# EasyEDA Pro project 可调电源.eprj, schematic 功率板
Board Name: Board1; Create Date: 2025-12-10; Page Name: p1; Project Name: 可调电源; Schematic Name: 功率板; Update Date: 2026-01-13; Company: 嘉立创EDA; Page Size: A4; Version: V1.0
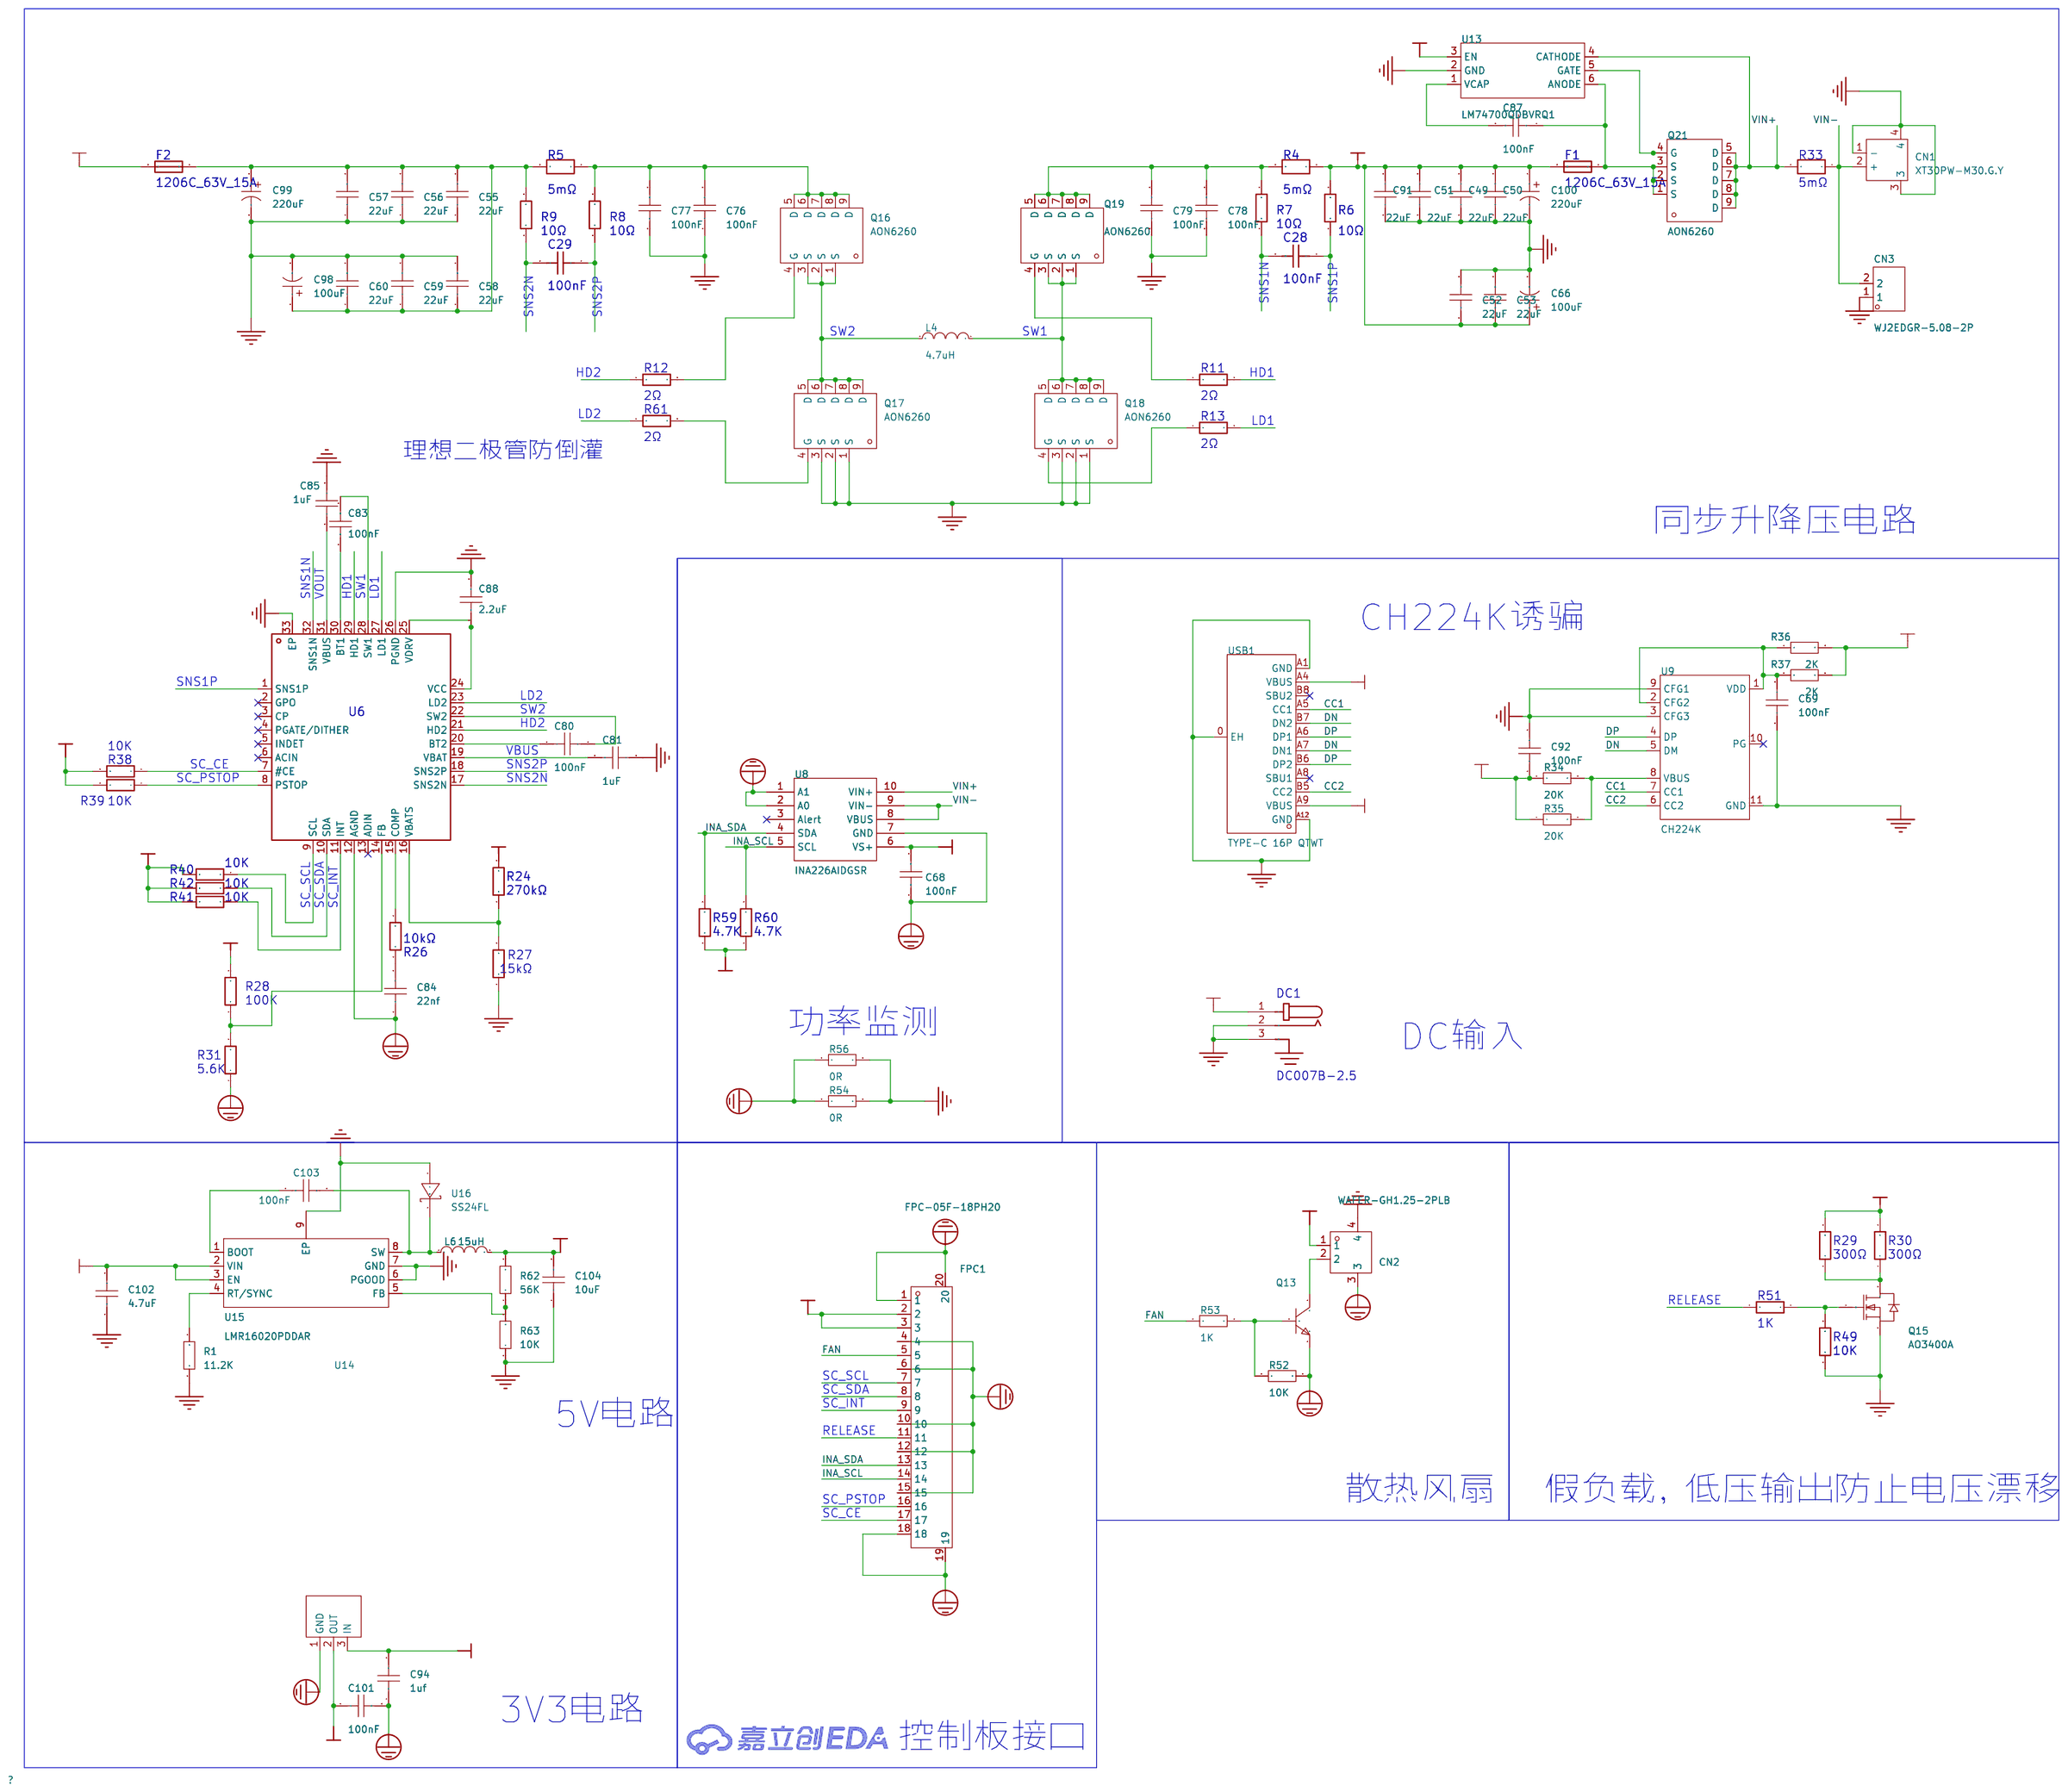
[diagram p0: schematic sheet]

## Parts
C28  100nF  [C0402]
C29  100nF  [C0402]
C49  22uF  [C1206]
C50  22uF  [C1206]
C51  22uF  [C1206]
C52  22uF  [C1206]
C53  22uF  [C1206]
C55  22uF  [C1206]
C56  22uF  [C1206]
C57  22uF  [C1206]
C58  22uF  [C1206]
C59  22uF  [C1206]
C60  22uF  [C1206]
C66  100uF  [CAP-SMD_BD8.0-L8.3-W8.3-LS9.0-FD]
C68  100nF  [C0603]
C69  100nF  [C0603]
C76  100nF  [C0603]
C77  100nF  [C0603]
C78  100nF  [C0603]
C79  100nF  [C0603]
C80  100nF  [C0402]
C81  1uF  [C0402]
C83  100nF  [C0402]
C84  22nf  [C0402]
C85  1uF  [C0402]
C87  100nF  [C0603]
C88  2.2uF  [C0402]
C91  22uF  [C1206]
C92  100nF  [C0603]
C94  1uf  [C0603]
C98  100uF  [CAP-SMD_BD8.0-L8.3-W8.3-LS9.0-FD]
C99  220uF  [CAP-SMD_BD10.0-L10.3-W10.3-FD-1]
C100  220uF  [CAP-SMD_BD10.0-L10.3-W10.3-FD-1]
C101  100nF  [C0603]
C102  4.7uF  [C0603]
C103  100nF  [C0603]
C104  10uF  [C0603]
CN1  XT30PW-M30.G.Y  [CONN-TH_XT30PW-M]
CN2  WAFER-GH1.25-2PLB  [CONN-TH_2P-P1.25_XUNPU_WAFER-GH1.25-2PLB]
CN3  WJ2EDGR-5.08-2P  [CONN-TH_WJ2EDGR-5.08-2P]
DC1  DC007B-2.5  [DC-IN-TH_HX-DC007B-2.5]
F1  1206C_63V_15A  [F1206]
F2  1206C_63V_15A  [F1206]
FPC1  FPC-05F-18PH20  [FPC-SMD_18P-P0.50_FPC-05F-18PH20]
L4  4.7uH  [IND-SMD_L13.45-W12.6]
L6  15uH  [IND-SMD_L4.0-W4.0]
Q13  -  [S8050_SOT-23]
Q15  AO3400A  [SOT-23-3_L2.9-W1.3-P1.90-LS2.4-BR]
Q16  AON6260  [PG-TDSON-8_L5.9-W5.2-P1.27-LS6.2-BL-EP]
Q17  AON6260  [PG-TDSON-8_L5.9-W5.2-P1.27-LS6.2-BL-EP]
Q18  AON6260  [PG-TDSON-8_L5.9-W5.2-P1.27-LS6.2-BL-EP]
Q19  AON6260  [PG-TDSON-8_L5.9-W5.2-P1.27-LS6.2-BL-EP]
Q21  AON6260  [PG-TDSON-8_L5.9-W5.2-P1.27-LS6.2-BL-EP]
R1  11.2K  [R0402]
R4  5mΩ  [R1206]
R5  5mΩ  [R1206]
R6  10Ω  [R0402]
R7  10Ω  [R0402]
R8  10Ω  [R0402]
R9  10Ω  [R0402]
R11  2Ω  [R0402]
R12  2Ω  [R0402]
R13  2Ω  [R0402]
R24  270kΩ  [R0402]
R26  10kΩ  [R0402]
R27  15kΩ  [R0402]
R28  100K  [R0402]
R29  300Ω  [R1206]
R30  300Ω  [R1206]
R31  5.6K  [R0402]
R33  5mΩ  [R1206]
R34  20K  [R0603]
R35  20K  [R0603]
R36  2K  [R0603]
R37  2K  [R0603]
R38  10K  [R0402]
R39  10K  [R0402]
R40  10K  [R0402]
R41  10K  [R0402]
R42  10K  [R0402]
R49  10K  [R0402]
R51  1K  [R0402]
R52  10K  [R0402]
R53  1K  [R0402]
R54  0R  [R0603]
R56  0R  [R0603]
R59  4.7K  [R0402]
R60  4.7K  [R0402]
R61  2Ω  [R0402]
R62  56K  [R0402]
R63  10K  [R0402]
U6  SC8815QDER  [QFN-32_L4.0-W4.0-P0.40-BL-EP2.7]
U8  INA226AIDGSR  [MSOP-10_L3.0-W3.0-P0.50-LS5.0-BL]
U9  CH224K  [ESSOP-10_L4.9-W3.9-P1.0-LS6.0-TL-EP]
U13  LM74700QDBVRQ1  [SOT-23-6_L2.9-W1.6-P0.95-LS2.8-BL]
U14  SCJA1117B-3.3-A  [SOT-89-3L_L4.5-W2.5-P1.50-LS4.1-BR]
U15  LMR16020PDDAR  [SOIC-8_L4.9-W3.9-P1.27-LS6.0-BL-EP]
U16  SS24FL  [SOD-123FL_L2.8-W1.8-LS3.6-RD]
USB1  TYPE-C 16P QTWT  [USB-TYPE-C-SMD_TYPE-C-16P-QTWT]

## Library data of the parts
C28 C29 = CL05B104KB54PNC: LCSC Part Name: 100nF ±10% 50V; Supplier Part: C307331; Manufacturer: SAMSUNG(三星); Supplier Footprint: 0402; JLCPCB Part Class: 基础库; Datasheet: https://atta.szlcsc.com/upload/public/pdf/source/20181009/C307331_222F7C870FD3EA5F46F538B483443886.pdf; Supplier: LCSC; Tolerance: ±10%; Voltage Rated: 50V; Temperature Coefficient: X7R
C49-C53 C55-C60 C91 = CAP_1206: Supplier Footprint: 1206
C66 C98 = SPT1JM470F09TRVZC: LCSC Part Name: 47uF ±20% 63V; Supplier Part: C48686160; Manufacturer: Yunxing(云星); Supplier Footprint: SMD,D8xL9mm; JLCPCB Part Class: 扩展库; Datasheet: https://item.szlcsc.com/datasheet/SPT1JM470F09TRVZC/50971402.html; Supplier: LCSC; Tolerance: ±20%; Voltage Rating: 63V; Pin Spacing: 3.5mm; Diameter: 8mm; Height - Seated (Max): 9mm; Lifetime: 2000hrs@105℃; Operating Temperature: -55℃~+105℃
C68 C69 C76-C79 C87 C92 C94 C101-C104 = CAP_0603: Supplier Footprint: 0603
C80 C81 C83-C85 C88 = CAP_0402: Supplier Footprint: 0402
C99 C100 = MA50V220M10x10: LCSC Part Name: 220uF ±20% 50V; Supplier Part: C46550473; Manufacturer: JIERR(捷而瑞); Supplier Footprint: SMD,D10xL10mm; JLCPCB Part Class: 扩展库; Datasheet: https://item.szlcsc.com/datasheet/MA50V220M10x10/48680167.html; Supplier: LCSC; Tolerance: ±20%; Voltage Rating: 50V; Ripple Current: 3.1A@100kHz; Equivalent Series Resistance(ESR): 30mΩ@100kHz; Type: 聚合物; Diameter: 10mm; Height - Seated (Max): 10mm; Lifetime: 2000hrs@105℃; Operating Temperature: -55℃~+105℃
CN1 = XT30PW-M30.G.Y: LCSC Part Name: AMASS(艾迈斯)航模插头 卧式弯脚 XT30PW-M公头; Supplier Part: C431092; Manufacturer: AMASS(艾迈斯); JLCPCB Part Class: 扩展库; Datasheet: https://item.szlcsc.com/datasheet/XT30PW-M30.G.Y/426930.html; Supplier: LCSC; Type: 航模插头; RatedVoltage: DC 500V; InterfaceType: 公头; RatedCurrent: 15A; RecommendedWireGauge: 16/18/20AWG; contact resistance: 1.2mΩ; specifications: 2pin
CN2 = WAFER-GH1.25-2PLB: LCSC Part Name: 1x2P 间距:1.25mm 立贴 系列:GH; Supplier Part: C3029368; Manufacturer: XUNPU(讯普); Supplier Footprint: SMD,P=1.25mm; JLCPCB Part Class: 扩展库; Datasheet: https://item.szlcsc.com/datasheet/WAFER-GH1.25-2PLB/3561380.html; Supplier: LCSC; Pins Structure: 1x2P; Pitch: 1.25mm; Mounting Type: 立贴; Reference Series: GH; Number of Pins: 2P; Number of Rows: 1; Number of PINs Per Row: 2; Current Rating: 1A; Contact Material: 黄铜; Contact Plating: 锡; Operating Temperature: -25℃~+85℃; Voltage Rating: 125V; Plastic Material: LCP; Supplementary Features: 辅助焊脚; Color: 米色; Z-Height of the Board: 4.2mm; X-Length of Bottom Edge on Board (Spacing Line): 5.75mm; Y-Width of Bottom Edge on Board: 4.95mm
CN3 = WJ2EDGR-5.08-2P: LCSC Part Name: 1x2P 5.08mm 排数:1 每排P数:2; Supplier Part: C8383; Manufacturer: KANGNEX(康奈克斯电气); Supplier Footprint: 弯插,P=5.08mm; JLCPCB Part Class: 扩展库; Datasheet: https://item.szlcsc.com/datasheet/WJ2EDGR-5.08-2P/8877.html; Supplier: LCSC; Connector Type: 板端/插座-开口; Number of Positions or Pins: 1x2P; Pitch: 5.08mm; Color: 绿色; Mounting Type: 弯针; Number of Pins: 2P; Number of Rows: 1; Number of PINs Per Row: 2; Operating Temperature: -40℃~+105℃
DC1 = DC007B-2.5: LCSC Part Name: DC电源插座 内径:2.5mm 外径:7.7mm; Supplier Part: C17701685; Manufacturer: SHOU HAN(首韩); Supplier Footprint: 插件; JLCPCB Part Class: 扩展库; Datasheet: https://atta.szlcsc.com/upload/public/pdf/source/20230912/B85EC3863CDA4EDD9FBFF38F4F2C356A.pdf; Supplier: LCSC; Connector Type: DC电源插座; Mounting Type: 弯插; Inside Contact Diameter: 2.5mm; Outside Contact Diameter: 7.7mm; Current Rating: 5A; Voltage Rating (Max): 20V; Operating Temperature: -25℃~+70℃
F1 F2 = BSMD1206C-2150T: LCSC Part Name: 1206 15A 32V 一次性 慢速熔断; Supplier Part: C41367234; Manufacturer: BHFUSE(佰宏); Supplier Footprint: 1206; JLCPCB Part Class: 扩展库; Datasheet: https://item.szlcsc.com/datasheet/BSMD1206C-2150T/43118987.html; Supplier: LCSC; Type: 贴片式保险丝; Current Rating: 15A; Voltage Rating (DC): 32V; Operating Temperature: -55℃~+150℃; Melting I2t: 18.2; Interrupt Rating: 150A
FPC1 = FPC-05F-18PH20: LCSC Part Name: 翻盖式 卧贴 P数:18P 间距:0.5mm; Supplier Part: C2856802; Manufacturer: XUNPU(讯普); Supplier Footprint: SMD,P=0.5mm,卧贴; JLCPCB Part Class: 扩展库; Datasheet: https://item.szlcsc.com/datasheet/FPC-05F-18PH20/3056900.html; Supplier: LCSC; Locking Feature: 翻盖式; Contact Type: 卧贴; Number of Contacts: 18P; Pitch: 0.5mm; Mounting Type: 下接; FFC, FCB Thickness: 0.3mm; Height Above Board: 2mm; Contact Material: 磷青铜; Contact Plating: 锡; Operating Temperature: -25℃~+85℃; Rated Voltage (Max): 50V; Current Rating (Max): 500mA
L4 = FXL1360-4R7-M: LCSC Part Name: 4.7uH ±20% 24A; Supplier Part: C526021; Manufacturer: cjiang(长江微电); Supplier Footprint: SMD,13.5x12.6mm; JLCPCB Part Class: 扩展库; Datasheet: https://item.szlcsc.com/datasheet/FXL1360-4R7-M/544126.html; Supplier: LCSC; Tolerance: ±20%; Current Rating: 20A; Current - Saturation(Isat): 24A; DC Resistance(DCR): 9mΩ; Type: 一体成型电感
L6 = FHD4020S-150MT: LCSC Part Name: 15uH ±20% 2.8A; Supplier Part: C602033; Manufacturer: cjiang(长江微电); Supplier Footprint: SMD,4x4mm; JLCPCB Part Class: 扩展库; Datasheet: https://atta.szlcsc.com/upload/public/pdf/source/20200609/C601990_BCEA243EC4DA0A9A288AA78A6DFB48A5.pdf; Supplier: LCSC; Tolerance: ±20%; Current Rating: 1.2A; Current - Saturation(Isat): 2.8A; DC Resistance(DCR): 305mΩ; Type: 绕线电感
Q13 = S8050_SOT_NPN: Supplier Footprint: SOT-23
Q15 = AO3400A_C20917: LCSC Part Name: 1个N沟道 耐压:30V 电流:5.7A; Supplier Part: C20917; Manufacturer: AOS; Supplier Footprint: SOT-23-3L; JLCPCB Part Class: 基础库; Datasheet: https://item.szlcsc.com/datasheet/AO3400A/21629.html; Supplier: LCSC; Drain to Source Voltage: 30V; RDS(on): 48mΩ@2.5V; Gate Threshold Voltage (Vgs(th)): 1.45V@250uA; Gate Charge(Qg): 7nC@10V; Input Capacitance(Ciss): 630pF@15V; Operating Temperature: -55℃~+150℃@(Tj); Type: N沟道
Q16-Q19 Q21 = AON6260: LCSC Part Name: 1个N沟道 耐压:60V 电流:41A 电流:85A; Supplier Part: C3288308; Manufacturer: AOS; Supplier Footprint: DFN-8(5x6); JLCPCB Part Class: 扩展库; Supplier: LCSC; Type: 1个N沟道; Drain Source Voltage (Vdss): 60V; Continuous Drain Current (Id): 85A；41A; Power Dissipation (Pd): 7.3W；104W; Drain Source On Resistance (RDS(on)@Vgs,Id): 2.4mΩ@20A,10V; Gate Threshold Voltage (Vgs(th)@Id): 2.5V@250uA; Total Gate Charge (Qg@Vgs): 115nC@10V; Input Capacitance (Ciss@Vds): 5.578nF@30V; Operating Temperature: -55℃~+150℃@(Tj)
R1 R52 R53 R62 R63 = Res_0402: Supplier Footprint: 0402
R4 R5 R33 = RLP25FEGMR010: LCSC Part Name: 10mΩ ±1% 3W; Supplier Part: C393072; Manufacturer: 大毅科技; Supplier Footprint: 2512; JLCPCB Part Class: Extended Part; Datasheet: https://atta.szlcsc.com/upload/public/pdf/source/20190801/C393072_75E0D801B8B57DDBFF67497AD9E82245.pdf; Supplier: LCSC; Type: 采样电阻; Tolerance: ±1%; Power(Watts): 3W; Temperature Coefficient: ±50ppm/℃; Mounting Sytle: 贴片
R6-R9 R11-R13 R61 = 0402WGF100JTCE: LCSC Part Name: 10Ω ±1% 62.5mW; Supplier Part: C25077; Manufacturer: UNI-ROYAL(厚声); Supplier Footprint: 0402; JLCPCB Part Class: 基础库; Datasheet: https://atta.szlcsc.com/upload/public/pdf/source/20200306/C422600_1E6D84923E4A46A82E41ADD87F860B5C.pdf; Supplier: LCSC; Type: 厚膜电阻; Tolerance: ±1%; Power(Watts): 62.5mW; Temperature Coefficient: ±200ppm/℃; Overload Voltage (Max): 50V; Operating Temperature Range: -55℃~+155℃
R24 = 0402WGF3302TCE: LCSC Part Name: 33kΩ ±1% 62.5mW; Supplier Part: C25779; Manufacturer: UNI-ROYAL(厚声); Supplier Footprint: 0402; JLCPCB Part Class: Basic Part; Datasheet: https://atta.szlcsc.com/upload/public/pdf/source/20200306/C422600_1E6D84923E4A46A82E41ADD87F860B5C.pdf; Supplier: LCSC; Type: 厚膜电阻; Tolerance: ±1%; Power(Watts): 62.5mW; Temperature Coefficient: ±100ppm/℃; Overload Voltage (Max): 50V; Operating Temperature Range: -55℃~+155℃
R26 = 0402WGF1002TCE: LCSC Part Name: 10kΩ ±1% 62.5mW; Supplier Part: C25744; Manufacturer: UNI-ROYAL(厚声); Supplier Footprint: 0402; JLCPCB Part Class: Basic Part; Datasheet: https://atta.szlcsc.com/upload/public/pdf/source/20200306/C422600_1E6D84923E4A46A82E41ADD87F860B5C.pdf; Supplier: LCSC; Type: 厚膜电阻; Tolerance: ±1%; Power(Watts): 62.5mW; Temperature Coefficient: ±100ppm/℃; Overload Voltage (Max): 50V; Operating Temperature Range: -55℃~+155℃; Check: true
R27 = 0402WGF1003TCE: LCSC Part Name: 100kΩ ±1% 62.5mW; Supplier Part: C25741; Manufacturer: UNI-ROYAL(厚声); Supplier Footprint: 0402; JLCPCB Part Class: Basic Part; Datasheet: https://atta.szlcsc.com/upload/public/pdf/source/20200306/C422600_1E6D84923E4A46A82E41ADD87F860B5C.pdf; Supplier: LCSC; Type: 厚膜电阻; Tolerance: ±1%; Power(Watts): 62.5mW; Temperature Coefficient: ±100ppm/℃; Overload Voltage (Max): 50V; Operating Temperature Range: -55℃~+155℃; Check: true
R28 R31 R38-R42 = RT0402BRD076K8L: LCSC Part Name: 6.8kΩ ±0.1% 62.5mW; Supplier Part: C281779; Manufacturer: YAGEO(国巨); Supplier Footprint: 0402; JLCPCB Part Class: 扩展库; Datasheet: https://atta.szlcsc.com/upload/public/pdf/source/20180906/C281779_D5427F576E6A8D3F24941A4EF74441F3.pdf; Supplier: LCSC; Type: 薄膜电阻; Tolerance: ±0.1%; Power(Watts): 62.5mW; Temperature Coefficient: ±25ppm/℃; Overload Voltage (Max): 50V; Operating Temperature Range: -55℃~+155℃
R29 R30 = 1206W4F100JT5E: LCSC Part Name: 10Ω ±1% 250mW 厚膜电阻; Supplier Part: C17903; Manufacturer: UNI-ROYAL(厚声); Supplier Footprint: 1206; JLCPCB Part Class: 基础库; Datasheet: https://atta.szlcsc.com/upload/public/pdf/source/20200306/C422600_1E6D84923E4A46A82E41ADD87F860B5C.pdf; Supplier: LCSC; Type: 厚膜电阻; Tolerance: ±1%; Power(Watts): 250mW; Overload Voltage (Max): 200V; Temperature Coefficient: ±400ppm/℃; Operating Temperature Range: -55℃~+155℃
R34-R37 R54 R56 = Res_0603: Supplier Footprint: 0603
R49 R51 R59 R60 = 0402WGF5101TCE: LCSC Part Name: 5.1KΩ(5101) ±1% 编带; Supplier Part: C25905; Manufacturer: UNI-ROYAL(厚声); Supplier Footprint: 0402; JLCPCB Part Class: Basic Part; Datasheet: https://atta.szlcsc.com/upload/public/pdf/source/20170920/C25905_1505895107382980911.pdf; Supplier: LCSC
U6 = SC8815QDER: link: https://item.szlcsc.com/213663.html; 3DModel: QFN-32_L4.0-W4.0-H0.8-P0.40; Supplier: LCSC; Supplier Part: C429908; Manufacturer: SOUTHCHIP(南芯); JLCPCB Part Class: 扩展库
U8 = INA226AIDGSR: Supplier Part: C49851; Manufacturer: TI(德州仪器); Supplier Footprint: MSOP-10; JLCPCB Part Class: 扩展库; Datasheet: https://item.szlcsc.com/datasheet/INA226AIDGSR/50860.html; Supplier: LCSC; Vcm - Common Mode Voltage: 300mV~40V; Ib - Input Bias Current: 10nA; Vos - Input Offset Voltage: 2.5uV; Operating Temperature: -40℃~+125℃; Differential Voltage: -40V~+40V; Single Supply: 2.7V~5.5V; Quiescent Current: 330uA; Input Offset Voltage Drift(Vos TC): 0.1uV/℃; Common Mode Rejection Ratio (CMRR): 140dB
U9 = CH224K: LCSC Part Name: USBPD等多快充协议受电芯片CH224; Supplier Part: C970725; Manufacturer: WCH(南京沁恒); Supplier Footprint: ESSOP-10-150mil-1mm; JLCPCB Part Class: 扩展库; Datasheet: https://item.szlcsc.com/datasheet/CH224K/1060460.html; Supplier: LCSC
U13 = LM74700QDBVRQ1_C2941042: LCSC Part Name: 低IQ电池反向保护理想二极管控制器; Supplier Part: C2941042; Manufacturer: TI(德州仪器); Supplier Footprint: SOT-23-6; JLCPCB Part Class: 扩展库; Datasheet: https://www.ti.com/cn/lit/gpn/lm74700-q1; Supplier: LCSC
U14 = SCJA1117B-3.3-A: LCSC Part Name: 低压差线性稳压器; Supplier Part: C2829327; Manufacturer: CJ(江苏长电/长晶); Supplier Footprint: SOT-89-3L; JLCPCB Part Class: 扩展库; Datasheet: https://item.szlcsc.com/datasheet/SCJA1117B-3.3-A/2979408.html; Supplier: LCSC; Output Type: 固定; Voltage - Supply: 15V; Output Voltage: 3.3V; Output Current: 1A; Power Supply Rejection Ratio (PSRR): 60dB@(1kHz); Voltage Dropout: 1.3V@(1A); standby current: 5mA; Features: 过热保护；过流保护; Operating Temperature: -20℃~+125℃@(Tj); Output Configuration: 正极; Number of Outputs: 1
U15 = LMR16020PDDAR: LCSC Part Name: 60V、2A降压转换器; Supplier Part: C190006; Manufacturer: TI(德州仪器); Supplier Footprint: SOIC-8-EP; JLCPCB Part Class: 扩展库; Datasheet: https://www.ti.com/cn/lit/gpn/lmr16020; Supplier: LCSC; Function: 降压型; Output Type: 可调; Voltage - Supply: 4.3V~60V; Output Voltage: 800mV~50V; Output Current: 2A; Frequency - Switching: 2.5MHz; Operating Temperature: -40℃~+125℃@(TJ); Synchronous Rectifier: 否; Number of Outputs: 1; Topology: 降压式; Switch tube (built-in/external): 内置
U16 = SS24FL_C894433: LCSC Part Name: 电压:40V 电流:2A; Supplier Part: C894433; Manufacturer: onsemi(安森美); Supplier Footprint: SOD-123F; JLCPCB Part Class: 扩展库; Datasheet: https://item.szlcsc.com/datasheet/SS24FL/959862.html; Supplier: LCSC; Voltage - Forward(Vf@If): 550mV@2A; Voltage - DC Reverse(Vr): 40V; Current - Rectified: 2A; Reverse Leakage Current (Ir): 100uA@40V; Operating Junction Temperature Range: -55℃~+125℃; Non-Repetitive Peak Forward Surge Current: 50A
USB1 = TYPE-C 16P QTWT: LCSC Part Name: Type-C 母 卧贴; Supplier Part: C5187472; Manufacturer: SHOU HAN(首韩); Supplier Footprint: SMD; JLCPCB Part Class: 扩展库; Datasheet: https://item.szlcsc.com/datasheet/TYPE-C%252016P%2520QTWT/5860367.html; Supplier: LCSC; Connector Type: Type-C; Protocol Standard: USB 3.1; Gender: 母; Mounting Type: 卧贴; Number of Contacts: 16P; Number of Ports: 1; Current Rating-Power: 3A; Voltage Rating: 5V; Connect-Disconnect Life: 5千次; Detection color: 黑色; Operating Temperature: -25℃~+85℃

## Nets
3V3: C68.2 C101.1 FPC1.2 FPC1.3 R38.2 R39.2 R40.2 R41.2 R42.2 R59.1 R60.1 U8.6(VS+) U14.2(OUT)
+5V: C94.2 C104.2 CN2.1 L6.2 R62.2 U13.3(EN) U14.3(IN)
GND: C68.1 C84.1 C94.1 C101.2 CN2.3 FPC1.1 FPC1.4 FPC1.6 FPC1.10 FPC1.12 FPC1.15 FPC1.18 FPC1.19 FPC1.20 Q13.2 R31.1 R52.2 R54.1 R56.1 U6.12(AGND) U8.1(A1) U8.2(A0) U8.7(GND) U14.1(GND)
PGND: C49.1 C50.1 C51.1 C52.2 C53.2 C55.1 C56.1 C57.1 C58.2 C59.2 C60.2 C66.2 C69.1 C76.1 C77.1 C78.1 C79.1 C81.2 C85.2 C88.2 C91.1 C92.2 C98.2 C99.2 C100.2 C102.1 C104.1 CN1.1(-) CN1.3 CN1.4 CN2.4 CN3.1 DC1.2 DC1.3 Q15.2(S) Q17.1(S) Q17.2(S) Q17.3(S) Q18.1(S) Q18.2(S) Q18.3(S) R1.1 R27.1 R49.1 R54.2 R56.2 R63.1 U6.26(PGND) U6.33(EP) U9.3(CFG3) U9.9(CFG1) U9.11(GND) U13.2(GND) U15.6(PGOOD) U15.7(GND) U15.9(EP) U16.2(A) USB1.0(EH) USB1.A1(GND) USB1.A12(GND)
VBUS: C81.1 C92.1 C102.2 DC1.1 F2.2 R24.2 R34.1 R35.1 R36.2 R37.2 U6.19(VBAT) U15.2(VIN) U15.3(EN) USB1.A4(VBUS) USB1.A9(VBUS)
VIN+: Q21.5(D) Q21.6(D) Q21.7(D) Q21.8(D) Q21.9(D) R33.2 U8.10(VIN+) U13.4(CATHODE)
VIN-: CN1.2(+) CN3.2 R33.1 U8.8(VBUS) U8.9(VIN-)
CC1: U9.7(CC1) USB1.A5(CC1)
CC2: U9.6(CC2) USB1.B5(CC2)
DN: U9.5(DM) USB1.A7(DN1) USB1.B7(DN2)
DP: U9.4(DP) USB1.A6(DP1) USB1.B6(DP2)
FAN: FPC1.5 R53.1
HD1: R11.2 U6.29(HD1)
HD2: R12.1 U6.21(HD2)
INA_SCL: FPC1.14 R60.2 U8.5(SCL)
INA_SDA: FPC1.13 R59.2 U8.4(SDA)
LD1: R13.2 U6.27(LD1)
LD2: R61.1 U6.23(LD2)
RELEASE: FPC1.11 R51.2
SC_CE: FPC1.17 R38.1 U6.7(#CE)
SC_INT: FPC1.9 R41.1 U6.11(INT)
SC_PSTOP: FPC1.16 R39.1 U6.8(PSTOP)
SC_SCL: FPC1.7 R40.1 U6.9(SCL)
SC_SDA: FPC1.8 R42.1 U6.10(SDA)
SNS1N: C28.2 R7.1 U6.32(SNS1N)
SNS1P: C28.1 R6.1 U6.1(SNS1P)
SNS2N: C29.2 R9.1 U6.17(SNS2N)
SNS2P: C29.1 R8.1 U6.18(SNS2P)
SW1: C83.2 L4.1 Q18.5(D) Q18.6(D) Q18.7(D) Q18.8(D) Q18.9(D) Q19.1(S) Q19.2(S) Q19.3(S) U6.28(SW1)
SW2: C80.2 L4.2 Q16.1(S) Q16.2(S) Q16.3(S) Q17.5(D) Q17.6(D) Q17.7(D) Q17.8(D) Q17.9(D) U6.22(SW2)
VOUT: C49.2 C50.2 C51.2 C52.1 C53.1 C66.1 C85.1 C91.2 C100.1 F1.2 R4.1 R6.2 R28.2 R29.2 R30.2 U6.31(VBUS)
$1N2476: C76.2 C77.2 Q16.5(D) Q16.6(D) Q16.7(D) Q16.8(D) Q16.9(D) R5.1 R8.2
$1N2477: C55.2 C56.2 C57.2 C58.1 C59.1 C60.1 C98.1 C99.1 F2.1 R5.2 R9.2
$1N2479: C78.2 C79.2 Q19.5(D) Q19.6(D) Q19.7(D) Q19.8(D) Q19.9(D) R4.2 R7.2
$1N2485: Q18.4(G) R13.1
$1N2486: Q17.4(G) R61.2
$1N2487: Q19.4(G) R11.1
$1N2488: Q16.4(G) R12.2
$1N3278: R28.1 R31.2 U6.14(FB)
$1N3292: R26.2 U6.15(COMP)
$1N3293: R24.1 R27.2 U6.16(VBATS)
$1N3300: C80.1 U6.20(BT2)
$1N3307: C88.1 U6.24(VCC) U6.25(VDRV)
$1N3315: C83.1 U6.30(BT1)
$1N3321: C84.2 R26.1
$1N4999: Q21.4(G) U13.5(GATE)
$1N5932: C87.1 F1.1 Q21.1(S) Q21.2(S) Q21.3(S) U13.6(ANODE)
$1N6492: R34.2 R35.2 U9.8(VBUS)
$1N6648: C69.2 R36.1 R37.1 U9.1(VDD) U9.2(CFG2)
$1N9982: Q15.3(D) R29.1 R30.1
$1N9984: Q15.1(G) R49.2 R51.1
$1N10475: Q13.1 R52.1 R53.2
$1N12258: C87.2 U13.1(VCAP)
$1N20822: CN2.2 Q13.3
$1N55647: C103.1 U15.1(BOOT)
$1N55652: C103.2 L6.1 U15.8(SW) U16.1(C)
$1N55760: R62.1 R63.2 U15.5(FB)
$1N55864: R1.2 U15.4(RT/SYNC)

Not connected (* = marked no-connect by the designer): U6 2(GPO)* 3(CP)* 4(PGATE/DITHER)* 5(INDET)* 6(ACIN)* 13(ADIN)*; U8 3(Alert)*; U9 10(PG)*; USB1 A8(SBU1)* B8(SBU2)*

## Notes on the sheet
- 理想二极管防倒灌
- 同步升降压电路
- CH224K诱骗
- 功率监测
- DC输入
- 5V电路
- 散热风扇
- 假负载，低压输出防止电压漂移
- 3V3电路
- 控制板接口
